# Altium schematic sheet microwaveBoardSimple.SchDoc
size Letter; SheetNumber: 1; SheetTotal: 1
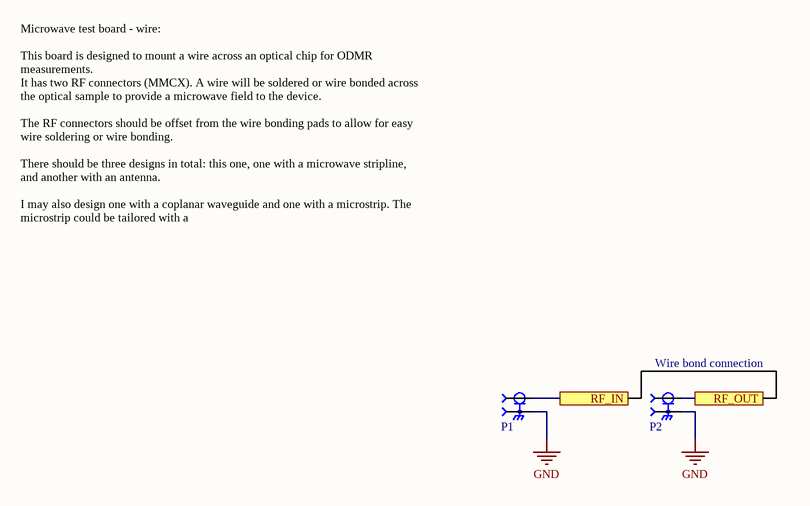
[diagram p0: microwaveBoardSimple.SchDoc]

## Parts
P1  MMCXV-J-P-HF-ST-EM1  [MMCXV-J-P-HF-ST-EM1]  (value not drawn)
P2  MMCXV-J-P-HF-ST-EM1  [MMCXV-J-P-HF-ST-EM1]  (value not drawn)

## Ports
RF_IN, RF_OUT

## Nets
GND: P1.2 P2.2
RF_IN: P1.1 ; port RF_IN
RF_OUT: P2.1 ; port RF_OUT

## Notes on the sheet
- Microwave test board - wire:
  This board is designed to mount a wire across an optical chip for ODMR measurements.
  It has two RF connectors (MMCX). A wire will be soldered or wire bonded across the optical sample to provide a microwave field to the device.
  The RF connectors should be offset from the wire bonding pads to allow for easy wire soldering or wire bonding.
  There should be three designs in total: this one, one with a microwave stripline, and another with an antenna.
  I may also design one with a coplanar waveguide and one with a microstrip. The microstrip could be tailored with a
- (near P2) Wire bond connection

## Library data of the parts
P1 P2 = PXX-SAM-00013: 50 OHM MMCX HIGH-VIBRATION JACK,; Index: 13; Designator: P?; Part Number: PXX-SAM-00013; Manufacturer Part Number: MMCXV-J-P-HF-ST-EM1; Supplier Part Number 1: MMCXV-J-P-HF-ST-EM1-ND; Supplier 1: Digi-key; Publisher: AlbertaSat; Published: 10/22/2021; LatestRevisionDate: 10/22/2021; LatestRevisionNote: ...; Supplier Link: #https://www.digikey.ca/en/products/detail/samtec-inc/MMCXV-J-P-HF-ST-EM1/10218387?s=N4IgTCBcDaILJwMIA0BqBaAUugCugEgGLoDKAKugKJwCMIAugL5A#